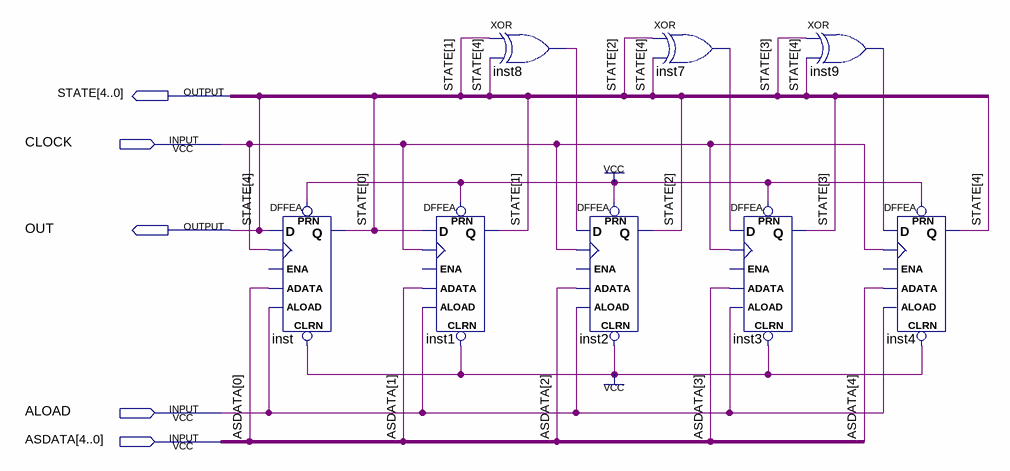
[diagram p0: schematic sheet]
// Quartus schematic Internal_MGenerator.bdf as structural Verilog: 8 symbols, 5 pins
module Internal_MGenerator (
  input  CLOCK,
  input  ALOAD,
  input  [4:0] ASDATA,
  output [4:0] STATE,
  output OUT
);

  wire inst7_out, inst8_out, inst9_out;

  DFFEA inst (
    .PRN(1'b1), .ALOAD(ALOAD), .ADATA(ASDATA[0]), .CLK(CLOCK), .D(OUT), .CLRN(1'b1), .Q(STATE[0]));  // open: ENA
  DFFEA inst1 (
    .PRN(1'b1), .ALOAD(ALOAD), .ADATA(ASDATA[1]), .CLK(CLOCK), .D(STATE[0]), .CLRN(1'b1), .Q(STATE[1]));  // open: ENA
  xor inst8 (inst8_out, STATE[1], OUT);
  DFFEA inst2 (
    .PRN(1'b1), .ALOAD(ALOAD), .ADATA(ASDATA[2]), .CLK(CLOCK), .D(inst8_out), .CLRN(1'b1), .Q(STATE[2]));  // open: ENA
  xor inst7 (inst7_out, STATE[2], OUT);
  DFFEA inst3 (
    .PRN(1'b1), .ALOAD(ALOAD), .ADATA(ASDATA[3]), .CLK(CLOCK), .D(inst7_out), .CLRN(1'b1), .Q(STATE[3]));  // open: ENA
  xor inst9 (inst9_out, STATE[3], OUT);
  DFFEA inst4 (
    .PRN(1'b1), .ALOAD(ALOAD), .ADATA(ASDATA[4]), .CLK(CLOCK), .D(inst9_out), .CLRN(1'b1), .Q(OUT));  // open: ENA

  assign STATE[4] = OUT;
endmodule
